# EAGLE design binw2 (EAGLE 7.6.0)
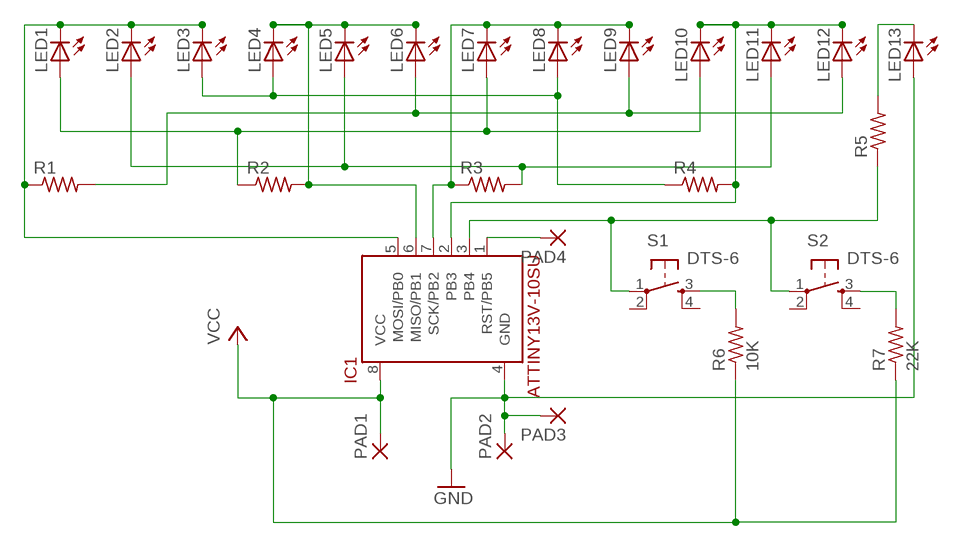
[diagram p0: schematic, sheet 1]

## Parts
IC1  ATTINY13V-10SU  [SOIC8]
LED1  LEDCHIP-LED0805  [CHIP-LED0805]
LED2  LEDCHIP-LED0805  [CHIP-LED0805]
LED3  LEDCHIP-LED0805  [CHIP-LED0805]
LED4  LEDCHIP-LED0805  [CHIP-LED0805]
LED5  LEDCHIP-LED0805  [CHIP-LED0805]
LED6  LEDCHIP-LED0805  [CHIP-LED0805]
LED7  LEDCHIP-LED0805  [CHIP-LED0805]
LED8  LEDCHIP-LED0805  [CHIP-LED0805]
LED9  LEDCHIP-LED0805  [CHIP-LED0805]
LED10  LEDCHIP-LED0805  [CHIP-LED0805]
LED11  LEDCHIP-LED0805  [CHIP-LED0805]
LED12  LEDCHIP-LED0805  [CHIP-LED0805]
LED13  LEDCHIP-LED0805  [CHIP-LED0805]
PAD1  1,6/0,8  [1,6/0,8]
PAD2  1,6/0,8  [1,6/0,8]
PAD3  1,6/0,8  [1,6/0,8]
PAD4  1,6/0,8  [1,6/0,8]
R1  R-US_R0805  [R0805]
R2  R-US_R0805  [R0805]
R3  R-US_R0805  [R0805]
R4  R-US_R0805  [R0805]
R5  R-US_R0805  [R0805]
R6  10K  R-US_R0805  [R0805]
R7  22K  R-US_R0805  [R0805]
S1  DTS-6  [DTS-6]
S2  DTS-6  [DTS-6]

## Nets
GND: IC1.4(GND) LED13.A PAD2.1(P) PAD3.1(P)
N$2: IC1.1(RST/PB5) PAD4.1(P)
N$3: R7.2 S2.3
N$4: LED13.C R5.2
N$5: IC1.3(PB4) R5.1 S1.1 S2.1
N$6: IC1.5(MOSI/PB0) LED1.C LED2.C LED3.C R1.1
N$7: LED1.A LED7.A LED10.A R2.1
N$8: IC1.6(MISO/PB1) LED4.C LED5.C LED6.C R2.2
N$9: IC1.7(SCK/PB2) LED7.C LED8.C LED9.C R3.1
N$10: IC1.2(PB3) LED10.C LED11.C LED12.C R4.2
N$11: LED3.A LED4.A LED8.A R4.1
N$12: R6.2 S1.3
N$13: LED2.A LED5.A LED11.A R3.2
N$14: LED6.A LED9.A LED12.A R1.2
VCC: IC1.8(VCC) PAD1.1(P) R6.1 R7.1
Unconnected: S1.2 S1.4 S2.2 S2.4

## Library data of the parts
IC1 = attiny13:ATTINY13V-10*
LED1-LED13 = led:LED: LED OSRAM: - CHIPLED LG R971, LG N971, LY N971, LG Q971, LY Q971, LO R971, LY R971 LH N974, LH R974 LS Q976, LO Q976, LY Q976 LO Q996 - Hyper CHIPLED LW Q18S LB Q993, LB Q99A, LB R99A - SideLED LS A670, LO A670, LY A670, LG A670, LP A670 LB A673, LV A673, LT A673, LW A673 LH A674 LY A675 LS A676, LA A676, LO A676, LY A676, LW A676 LS A679, LY A679, LG A679 - Hyper Micro SIDELED® LS Y876, LA Y876, LO Y876, LY Y876 LT Y87S - SmartLED LW L88C, LW L88S LB L89C, LB L89S, LG L890 LS L89K, LO L89K, LY L89K LS L896, LA L896, LO L896, LY L896 - TOPLED LS T670, LO T670, LY T670, LG T670, LP T670 LSG T670, LSP T670, LSY T670, LOP T670, LYG T670 LG T671, LOG T671, LSG T671 LB T673, LV T673, LT T673, LW T673 LH T674 LS T676, LA T676, LO T676, LY T676, LB T676, LH T676, LSB T676, LW T676 LB T67C, LV T67C, LT T67C, LS T67K, LO T67K, LY T67K, LW E67C LS E67B, LA E67B, LO E67B, LY E67B, LB E67C, LV E67C, LT E67C LW T67C LS T679, LY T679, LG T679 LS T770, LO T770, LY T770, LG T770, LP T770 LB T773, LV T773, LT T773, LW T773 LH T774 LS E675, LA E675, LY E675, LS T675 LS T776, LA T776, LO T776, LY T776, LB T776 LHGB T686 LT T68C, LB T68C - Hyper Mini TOPLED® LB M676 - Mini TOPLED Santana® LG M470 LS M47K, LO M47K, LY M47K Source: http://www.osram.convergy.de LUXEON: - LUMILED® LXK2-PW12-R00, LXK2-PW12-S00, LXK2-PW14-U00, LXK2-PW14-V00 LXK2-PM12-R00, LXK2-PM12-S00, LXK2-PM14-U00 LXK2-PE12-Q00, LXK2-PE12-R00, LXK2-PE12-S00, LXK2-PE14-T00, LXK2-PE14-U00 LXK2-PB12-K00, LXK2-PB12-L00, LXK2-PB12-M00, LXK2-PB14-N00, LXK2-PB14-P00, LXK2-PB14-Q00 LXK2-PR12-L00, LXK2-PR12-M00, LXK2-PR14-Q00, LXK2-PR14-R00 LXK2-PD12-Q00, LXK2-PD12-R00, LXK2-PD12-S00 LXK2-PH12-R00, LXK2-PH12-S00 LXK2-PL12-P00, LXK2-PL12-Q00, LXK2-PL12-R00 Source: www.luxeon.com KINGBRIGHT: KA-3528ASYC Source: www.kingbright.com
PAD1-PAD4 = wirepad:1,6/0,8: THROUGH-HOLE PAD
R1-R7 = resistor:R-US_: RESISTOR, American symbol
S1 S2 = switch-tact:DTS-6

## Board
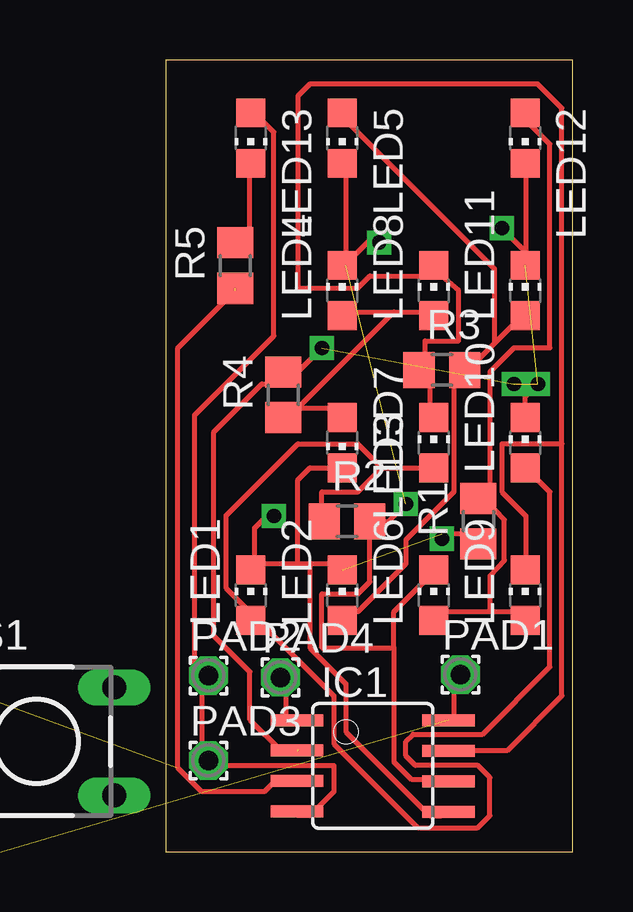
[diagram p1: board, top side]

Size 16.95 x 33.01 mm. Coordinates in mm from the lower left corner, seen from the top.
Outline: 0,0 16.95,0 16.95,33.01 0,33.01 0,0
Copper layers (1*16): Top 0.035mm / dielectric 1.5mm / Bottom 0.035mm
Design rules "default": minimum track width 8mil, minimum drill 12mil, track to track 5mil, track to pad 5mil, pad to pad 5mil, via to via 5mil, smd to smd 5mil, copper to edge 10mil, drill to drill 5mil, minimum pad ring 10mil, minimum via ring 8mil, stop-mask expansion 4mil, vias tented up to drill 0mil, thermal gap 10mil

### Footprints (pad centres in the part's own frame; a part is rotated, then mirrored left to right if it is on the bottom)
SOIC8 = smd 0.5 x 2.2: 1 -1.905,-3.154; 2 -0.645,-3.154; 3 0.625,-3.154; 4 1.895,-3.154; 5 1.905,3.154; 6 0.635,3.154; 7 -0.635,3.154; 8 -1.905,3.154
CHIP-LED0805 = smd 1.2 x 1.2: A 0,-1.05; C 0,1.05
1,6/0,8 = drill 0.813 pad 1.6 octagon: 1 0,0
R0805 = smd 1.3 x 1.5: 1 -0.95,0; 2 0.95,0
DTS-6 = drill 1 long: 1 -3.25,2.25; 2 3.25,2.25; 3 -3.25,-2.25; 4 3.25,-2.25

### Placement (x,y rotation side)
IC1  8.62,3.58 270 top
LED1  3.54,10.7 0 top
LED2  7.35,10.7 0 top
LED3  7.35,17.05 180 top
LED4  7.35,23.4 0 top
LED5  7.35,29.75 180 top
LED6  11.16,10.7 0 top
LED7  11.16,17.05 0 top
LED8  11.16,23.4 0 top
LED9  14.97,10.7 0 top
LED10  14.97,17.05 0 top
LED11  14.97,23.4 0 top
LED12  14.97,29.75 180 top
LED13  3.54,29.75 180 top
PAD1  12.27,7.39 0 top
PAD2  1.77,7.35 0 top
PAD3  1.77,3.81 0 top
PAD4  4.77,7.27 0 top
R1  13.02,13.78 90 top
R2  7.55,13.78 0 top
R3  11.5,20.09 0 top
R4  4.89,19.05 90 top
R5  2.89,24.44 90 top
R6  -19.4,-4 0 top  (outside the outline)
R7  -19.4,-8 0 top  (outside the outline)
S1  -5.4,4.6 0 top
S2  -16.1,4.6 0 top  (outside the outline)

### Tracks (layer width: path | path; a pad name or v marks a point on that pad's centre or on a via)
GND
  Top 0.203: IC1.4 5.5,1.5 6,1.5 7,2.5 7,3.6 2,3.6 PAD3.1 1.5,4 1.5,7 PAD2.1 1.2,7.8 1.2,18.2 4.5,21.5 4.5,30 4,30.5 LED13.A
N$2
  Top 0.203: IC1.1 5,5.5 5,7 PAD4.1
N$3  (1 unrouted)
N$4
  Top 0.203: LED13.C 3.5,28.5 3.5,26 3,25.5 R5.2
N$5  (3 unrouted)
  Top 0.203: IC1.3 4.6,3 4.1,2.5 1.5,2.5 0.5,3.5 0.5,21 2.89,23.39
N$6  (1 unrouted)
  Top 0.203: 7,12 6,12 | 6,12 5.5,12 | 5.5,12 4,12 LED1.C | 7,12 LED2.C | 6,12 6,8.5 7.5,7 7.5,5 10.75,1.75 | LED2.C 7.25,11.75 7,12 | 5.5,12 5.5,15.5 6,16 LED3.C 7,16 | 10.75,1.75 11.75,1.75 | 10.75,1.75 11,1.5 11.5,1.5 IC1.5 | R1.1 12.7,13.25 11.5,13.25 | LED2.C 7.1,12 3.6,12 3.7,12.1 3.7,13.5 4.2,14 4.5,14
N$7
  Top 0.203: R2.1 6.5,14 6.5,15 8,15 9,16 | 9,16 LED7.A | LED10.A 15,16 16,15 16,7.7 13.2,4.9 10.3,4.9 10,4.6 10,4 10.4,3.6 13,3.6 13.5,3.1 13.5,1.5 13,1 10.5,1 7,4.5 7,6.5 4,9.5 LED1.A 3.5,10 2.5,11 2.5,14 5.5,17 8,17 9,16
N$8  (1 unrouted)
  Top 0.203: 7.5,24.5 7.5,28.5 LED5.C | 7.5,24.5 LED4.C 7.5,24.45 7.5,24.5 | LED6.C 11,11.5 9.5,10 9.5,8.5 | IC1.6 11.5,3 10.25,3 9.5,3.75 9.5,8.5 | 7.5,24.5 8.5,25.5 9,25.5 | 10,14.5 9.28,13.78 R2.2 8.5,13.5 8.5,11.25 8,10.75 6.5,10.75 6.5,8.5 9.5,8.5
N$9
  Top 0.203: LED7.C 11,18.5 11,20 R3.1 10.8,20.24 10.8,21.3 12.2,21.3 12.2,23.4 11.5,24 LED8.C 11,24 8.5,24 8,23.5 5.5,23.5 5.5,31.5 6,32 15.5,32 16.5,31 16.5,17 | 16.5,17 16.5,6.5 14.21,4.21 IC1.7 | 16.5,17 14,17 14,15 15,14 15,12 LED9.C
N$10  (4 unrouted)
  Top 0.203: LED12.C 15,28.5 15,24.5 LED11.C 14.97,25.03 14,26 | LED10.C 14.5,18.1 | 6.5,21 5.4,19.9 R4.2 4.5,19.5 4,19.5 2,17.5 2,9 3.5,7.5 3.5,5.5 4.8,4.2 5.5,4.2 | LED10.C 14.97,18.97 15.5,19.5 | LED10.C 14.97,19.03 14.5,19.5 | 4.75,4.25 5.5,4.25
N$11
  Top 0.203: 7.5,22 LED4.A 7.5,22.5 9.5,22.5 | 9.5,22.5 11,22.5 LED8.A | 5.5,18.5 5,18.5 R4.1 5.5,18.5 | 9.5,22.5 5.5,18.5 | 5.5,18.5 7,18.5 LED3.A
N$12  (1 unrouted)
N$13
  Top 0.203: LED2.A 7.5,10 8,10 10,12 10,13 12,15 12,20 R3.2 12.5,20 13.7,21.2 | 13.7,21.2 14.5,22 LED11.A | 13.7,21.2 13.7,24.3 7.5,30.5 LED5.A
N$14
  Top 0.203: 13.5,10 14.5,10 LED9.A | 13.5,10 11.5,10 LED6.A | LED12.A 15,30.5 16,29.5 16,21 14.5,21 13.5,20 13.5,15 R1.2 13.37,14.63 14.1,13.85 14.1,12.15 13.5,11.5 13.5,10
N$15  (via drill 0.6)  (2 unrouted)
  other vias: 15.5,19.5 14.5,19.5 6.5,21
N$16  (via drill 0.6)
  other vias: 8.89,25.4
N$17  (via drill 0.6)
  other vias: 10,14.5
N$18  (via drill 0.6)
  other vias: 11.5,13.05
N$19  (via drill 0.6)
  other vias: 4.5,14
N$20  (via drill 0.6)
  other vias: 14,26
VCC  (2 unrouted)
  Top 0.203: IC1.8 12,5.5 12,7 PAD1.1